# Altium schematic sheet System.SchDoc
size A4
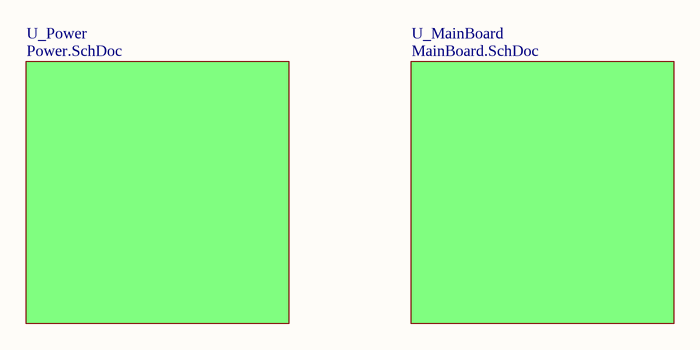
[diagram p0: System.SchDoc]

## Sub-sheets
U_MainBoard = MainBoard.SchDoc: no entries
U_Power = Power.SchDoc: no entries

## Notes on the sheet
- Title
- Size:
- Date:
- A4
- Number:
- Time:
- Revision:
- Sheet
- of
- File: